# Altium schematic sheet AMPLIFIER.SchDoc
size A4; SheetNumber: 1; SheetTotal: 6
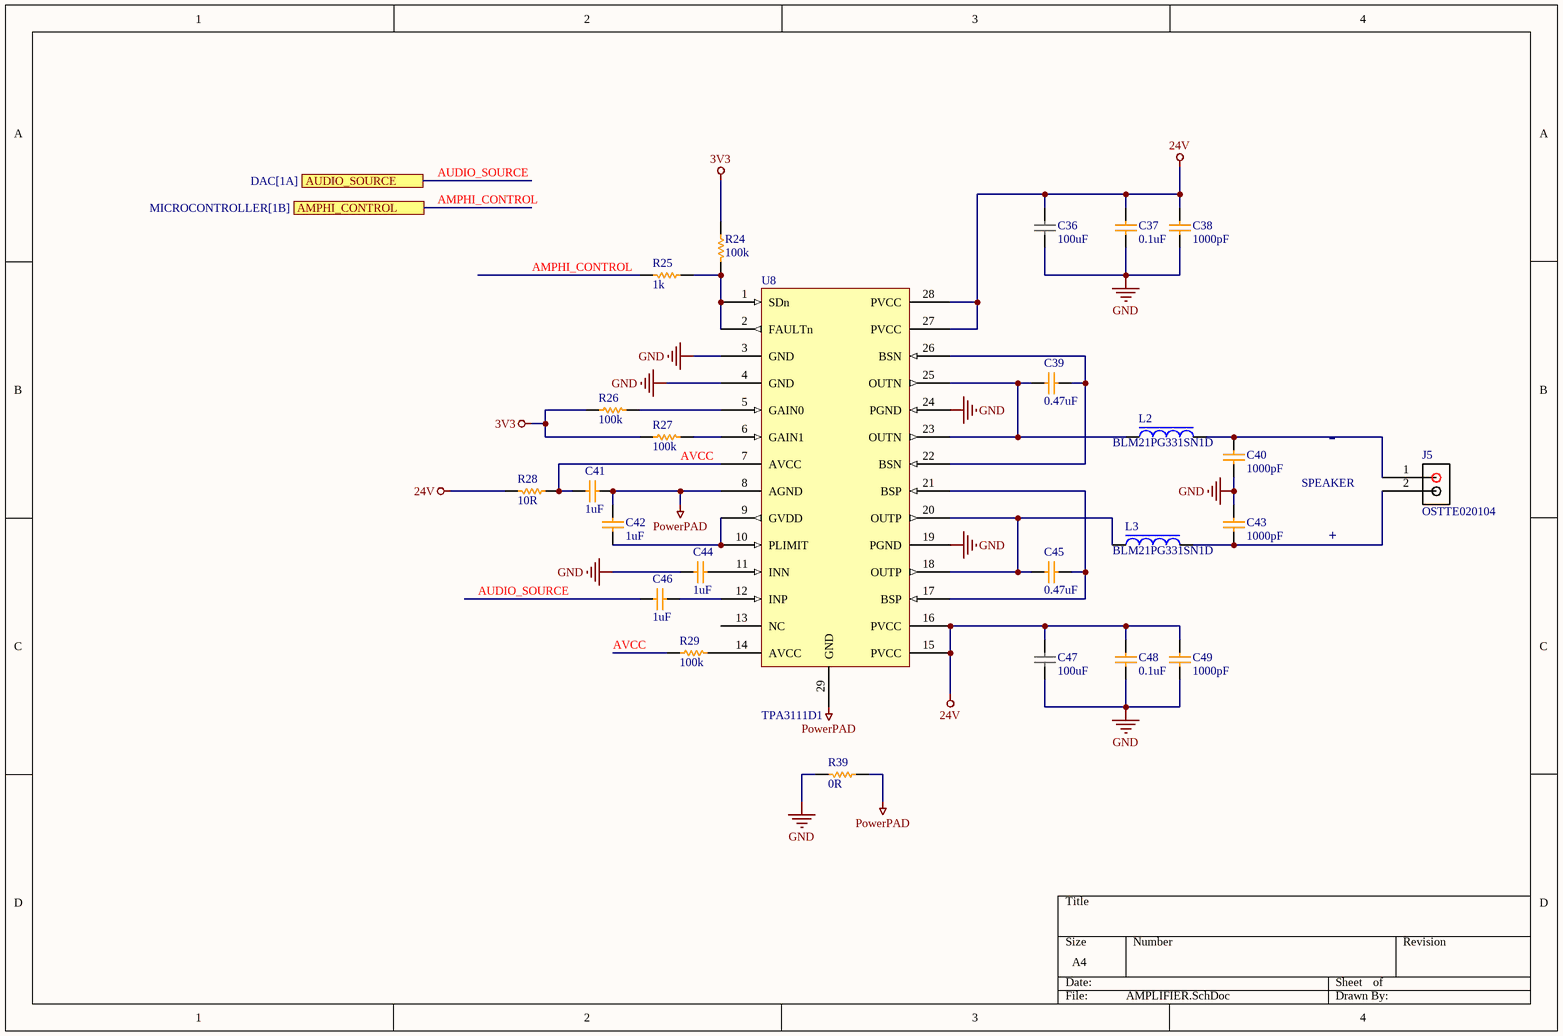
[diagram p0: AMPLIFIER.SchDoc]

## Parts
C36  100uF  [CAP-SMD-10x10]
C37  0.1uF  [CAP-0603]
C38  1000pF  [CAP-0603]
C39  0.47uF  [CAP-0603]
C40  1000pF  [CAP-0603]
C41  1uF  [CAP-0603]
C42  1uF  [CAP-0603]
C43  1000pF  [CAP-0603]
C44  1uF  [CAP-0603]
C45  0.47uF  [CAP-0603]
C46  1uF  [CAP-0603]
C47  100uF  [CAP-SMD-10x10]
C48  0.1uF  [CAP-0603]
C49  1000pF  [CAP-0603]
J5  OSTTE020104  [TERMBLK-P3.5-SIDEENT]
L2  BLM21PG331SN1D  [FB-0805]
L3  BLM21PG331SN1D  [FB-0805]
R24  100k  [RES-0603]
R25  1k  [RES-0603]
R26  100k  [RES-0603]
R27  100k  [RES-0603]
R28  10R  [RES-0603]
R29  100k  [RES-0603]
R39  0R  [RES-0603]
U8  TPA3111D1  [28HTSSOP]

## Ports
AMPHI_CONTROL (see MICROCONTROLLER[1B]), AUDIO_SOURCE (see DAC[1A])

## Nets
3V3: R24.2 R26.2 R27.2
24V: C36.1 C37.2 C38.2 C47.1 C48.2 C49.2 R28.1 U8.15(PVCC) U8.16(PVCC) U8.27(PVCC) U8.28(PVCC)
GND: C36.2 C37.1 C38.1 C40.1 C43.2 C44.1 C47.2 C48.1 C49.1 R39.1 U8.3(GND) U8.4(GND) U8.19(PGND) U8.24(PGND)
PowerPAD: C41.2 C42.2 R39.2 U8.8(AGND) U8.29(GND)
AMPHI_CONTROL: R25.1 ; port AMPHI_CONTROL
AUDIO_SOURCE: C46.1 ; port AUDIO_SOURCE
AVCC: C41.1 R28.2 R29.2 U8.7(AVCC)
NetC39_1: C39.1 L2.1 U8.23(OUTN) U8.25(OUTN)
NetC39_2: C39.2 U8.22(BSN) U8.26(BSN)
NetC40_2: C40.2 J5.1 L2.2
NetC42_1: C42.1 U8.9(GVDD) U8.10(PLIMIT)
NetC43_1: C43.1 J5.2 L3.2
NetC44_2: C44.2 U8.11(INN)
NetC45_1: C45.1 L3.1 U8.18(OUTP) U8.20(OUTP)
NetC45_2: C45.2 U8.17(BSP) U8.21(BSP)
NetC46_2: C46.2 U8.12(INP)
NetR24_1: R24.1 R25.2 U8.1(SDn) U8.2(FAULTn)
NetR26_1: R26.1 U8.5(GAIN0)
NetR27_1: R27.1 U8.6(GAIN1)
NetR29_1: R29.1 U8.14(AVCC)

Not connected (* = marked no-connect by the designer): U8 13(NC)

## Notes on the sheet
- -
- SPEAKER
- +

## Library data of the parts
C36 C47 = CAP-SMD-ALUM: CAP ALUM 100UF 20% 50V SMD(UUQ1H101MCL1GS)
C37 C48 = CAP-0603: CAP CER 0.1UF 50V X7R 0805
C38 C40 C43 C49 = CAP-0603: CAP CER 1000PF 50V X7R 0603
C39 C45 = CAP-0603: CAP CER 0.47UF 50V X7R 0805
C41 C42 C44 C46 = CAP-0603: CAP CER 1UF 25V X7R 0603
J5 = OSTTE020104: TERM BLK 2POS SIDE ENT 3.5MM PCB
L2 L3 = FB-0805: FERRITE BEAD 330 OHM 0805 1LN
R24 R26 R27 R29 = RES-0603: RES SMD 100K OHM 1% 1/10W 0603
R25 = RES-0603: RES SMD 1K OHM 1% 1/10W 0603
R28 = RES-0603: RES SMD 10 OHM 1% 1/10W 0603
R39 = RES-0603: RES SMD 0 OHM 1% 1/10W 0603
U8 = TPA3111D1: IC AMP CLASS D MONO 10W 28HTSSOP